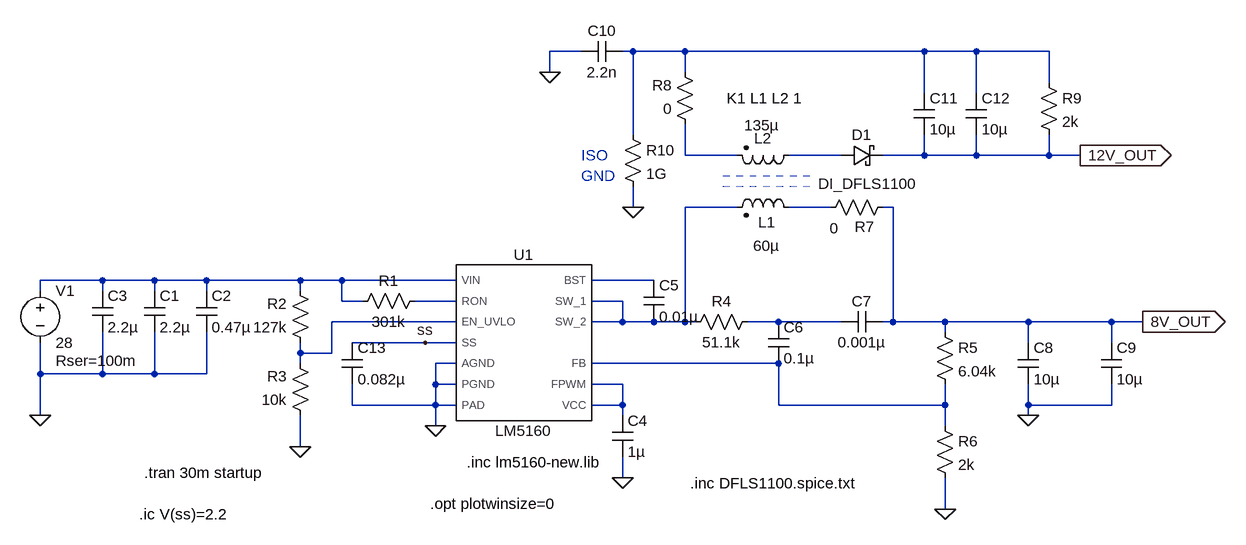
[diagram p0: schematic LM5160prob-fixed.asc]
LM5160prob-fixed.asc, the LTspice schematic file:
Version 4
SHEET 1 1112 680
WIRE 96 -240 48 -240
WIRE 176 -240 160 -240
WIRE 256 -240 176 -240
WIRE 624 -240 256 -240
WIRE 704 -240 624 -240
WIRE 816 -240 704 -240
WIRE 48 -208 48 -240
WIRE 256 -208 256 -240
WIRE 816 -192 816 -240
WIRE 624 -176 624 -240
WIRE 704 -176 704 -240
WIRE 176 -112 176 -240
WIRE 256 -80 256 -128
WIRE 336 -80 256 -80
WIRE 496 -80 416 -80
WIRE 624 -80 624 -112
WIRE 624 -80 560 -80
WIRE 704 -80 704 -112
WIRE 704 -80 624 -80
WIRE 816 -80 816 -112
WIRE 816 -80 704 -80
WIRE 864 -80 816 -80
WIRE 176 0 176 -32
WIRE 336 0 256 0
WIRE 480 0 416 0
WIRE 576 0 560 0
WIRE -640 112 -736 112
WIRE -560 112 -640 112
WIRE -480 112 -560 112
WIRE -336 112 -480 112
WIRE -272 112 -336 112
WIRE -96 112 -272 112
WIRE 208 112 112 112
WIRE -736 128 -736 112
WIRE -640 128 -640 112
WIRE -560 128 -560 112
WIRE -480 128 -480 112
WIRE -336 128 -336 112
WIRE -272 144 -272 112
WIRE -240 144 -272 144
WIRE -96 144 -160 144
WIRE 160 144 112 144
WIRE -96 176 -288 176
WIRE 160 176 160 144
WIRE 160 176 112 176
WIRE 208 176 160 176
WIRE 256 176 256 0
WIRE 256 176 208 176
WIRE 272 176 256 176
WIRE 400 176 352 176
WIRE 496 176 400 176
WIRE 576 176 576 0
WIRE 576 176 560 176
WIRE 656 176 576 176
WIRE 784 176 656 176
WIRE 912 176 784 176
WIRE 960 176 912 176
WIRE 656 192 656 176
WIRE -144 208 -256 208
WIRE -96 208 -144 208
WIRE 784 208 784 176
WIRE 912 208 912 176
WIRE -336 224 -336 208
WIRE -288 224 -288 176
WIRE -288 224 -336 224
WIRE -336 240 -336 224
WIRE -96 240 -128 240
WIRE 400 240 112 240
WIRE -736 256 -736 208
WIRE -640 256 -640 192
WIRE -640 256 -736 256
WIRE -560 256 -560 192
WIRE -560 256 -640 256
WIRE -480 256 -480 192
WIRE -480 256 -560 256
WIRE -128 272 -128 240
WIRE -96 272 -128 272
WIRE 160 272 112 272
WIRE -256 304 -256 272
WIRE -128 304 -128 272
WIRE -128 304 -256 304
WIRE -96 304 -128 304
WIRE 160 304 160 272
WIRE 160 304 112 304
WIRE 400 304 400 240
WIRE 656 304 656 272
WIRE 656 304 400 304
WIRE 784 304 784 272
WIRE 912 304 912 272
WIRE 912 304 784 304
WIRE -736 320 -736 256
WIRE 160 320 160 304
WIRE 784 320 784 304
WIRE -128 336 -128 304
WIRE 656 336 656 304
WIRE -336 368 -336 320
WIRE 160 416 160 384
WIRE 656 464 656 416
FLAG -736 320 0
FLAG -128 336 0
FLAG -336 368 0
FLAG 160 416 0
FLAG 784 320 0
FLAG 656 464 0
FLAG 48 -208 0
FLAG -144 208 ss
FLAG 864 -80 12V_OUT
IOPIN 864 -80 Out
FLAG 960 176 8V_OUT
IOPIN 960 176 Out
FLAG 176 0 0
SYMBOL VOLTAGE -736 112 R0
WINDOW 123 0 0 Left 2
WINDOW 39 24 124 Left 2
SYMATTR SpiceLine Rser=100m
SYMATTR InstName V1
SYMATTR Value 28
SYMBOL cap -576 128 R0
SYMATTR InstName C1
SYMATTR Value 2.2µ
SYMATTR SpiceLine V=50 Irms=5.54 Rser=0.0279723 Lser=0 mfg="KEMET" pn="C1812C225K5RAC" type="X7R"
SYMBOL cap -496 128 R0
SYMATTR InstName C2
SYMATTR Value 0.47µ
SYMATTR SpiceLine V=50 Irms=1.32 Rser=0.0460968 Lser=0 mfg="KEMET" pn="C1206C474K5RAC" type="X7R"
SYMBOL res -144 128 R90
WINDOW 0 0 56 VBottom 2
WINDOW 3 32 56 VTop 2
SYMATTR InstName R1
SYMATTR Value 301k
SYMBOL res -320 224 R180
WINDOW 0 36 76 Left 2
WINDOW 3 36 40 Left 2
SYMATTR InstName R2
SYMATTR Value 127k
SYMBOL res -320 336 R180
WINDOW 0 36 76 Left 2
WINDOW 3 36 40 Left 2
SYMATTR InstName R3
SYMATTR Value 10k
SYMBOL cap 144 320 R0
SYMATTR InstName C4
SYMATTR Value 1µ
SYMATTR SpiceLine V=16 Irms=0 Rser=0.007 Lser=0 mfg="TDK" pn="C3216X7RIC105K" type="X7R"
SYMBOL cap 192 112 R0
SYMATTR InstName C5
SYMATTR Value 0.01µ
SYMATTR SpiceLine V=16 Irms=272m Rser=0.391699 Lser=0 mfg="KEMET" pn="C0805C103K4RAC" type="X7R"
SYMBOL cap 384 176 R0
SYMATTR InstName C6
SYMATTR Value 0.1µ
SYMATTR SpiceLine V=16 Irms=1.02 Rser=0.0850352 Lser=0 mfg="KEMET" pn="C1206F104K4RAC" type="X7R"
SYMBOL res 368 160 R90
WINDOW 0 0 56 VBottom 2
WINDOW 3 32 56 VTop 2
SYMATTR InstName R4
SYMATTR Value 51.1k
SYMBOL cap 560 160 R90
WINDOW 0 0 32 VBottom 2
WINDOW 3 32 32 VTop 2
SYMATTR InstName C7
SYMATTR Value 0.001µ
SYMATTR SpiceLine V=16 Irms=65.8m Rser=2.70485 Lser=0 mfg="KEMET" pn="C0805C102K4RAC" type="X7R"
SYMBOL res 640 176 R0
SYMATTR InstName R5
SYMATTR Value 6.04k
SYMBOL res 640 320 R0
SYMATTR InstName R6
SYMATTR Value 2k
SYMBOL ind2 432 16 M270
WINDOW 0 -22 50 VTop 2
WINDOW 3 -27 51 VBottom 2
SYMATTR InstName L1
SYMATTR Value 60µ
SYMATTR Type ind
SYMATTR SpiceLine Rser=0.071
SYMBOL ind2 432 -96 R90
WINDOW 0 5 56 VBottom 2
WINDOW 3 -46 58 VTop 2
SYMATTR InstName L2
SYMATTR Value 135µ
SYMATTR Type ind
SYMATTR SpiceLine Rser=0.211
SYMBOL res 576 -16 R90
WINDOW 0 61 44 VBottom 2
WINDOW 3 32 91 VTop 2
SYMATTR InstName R7
SYMATTR Value 0
SYMBOL res 272 -112 R180
WINDOW 0 36 76 Left 2
WINDOW 3 36 40 Left 2
SYMATTR InstName R8
SYMATTR Value 0
SYMBOL cap 160 -256 R90
WINDOW 0 0 32 VBottom 2
WINDOW 3 32 32 VTop 2
SYMATTR InstName C10
SYMATTR Value 2.2n
SYMBOL schottky 496 -64 R270
WINDOW 0 32 32 VTop 2
WINDOW 3 -12 41 VBottom 2
SYMATTR InstName D1
SYMATTR Value DI_DFLS1100
SYMBOL cap 608 -176 R0
SYMATTR InstName C11
SYMATTR Value 10µ
SYMATTR SpiceLine V=16 Irms=7.16 Rser=0.00732742 Lser=0 mfg="KEMET" pn="C1206C106K4PAC" type="X5R"
SYMBOL cap 688 -176 R0
SYMATTR InstName C12
SYMATTR Value 10µ
SYMATTR SpiceLine V=16 Irms=7.16 Rser=0.00732742 Lser=0 mfg="KEMET" pn="C1206C106K4PAC" type="X5R"
SYMBOL res 800 -208 R0
SYMATTR InstName R9
SYMATTR Value 2k
SYMBOL cap -272 208 R0
SYMATTR InstName C13
SYMATTR Value 0.082µ
SYMATTR SpiceLine V=16 Irms=3.31 Rser=0.0495853 Lser=0 mfg="KEMET" pn="C0402C823K4RAC" type="X7R"
SYMBOL LM5160 0 208 R0
SYMATTR InstName U1
SYMBOL cap 768 208 R0
SYMATTR InstName C8
SYMATTR Value 10µ
SYMATTR SpiceLine V=16 Irms=7.16 Rser=0.00732742 Lser=0 mfg="KEMET" pn="C1206C106K4PAC" type="X5R"
SYMBOL cap 896 208 R0
SYMATTR InstName C9
SYMATTR Value 10µ
SYMATTR SpiceLine V=16 Irms=7.16 Rser=0.00732742 Lser=0 mfg="KEMET" pn="C1206C106K4PAC" type="X5R"
SYMBOL cap -656 128 R0
SYMATTR InstName C3
SYMATTR Value 2.2µ
SYMATTR SpiceLine V=50 Irms=5.54 Rser=0.0279723 Lser=0 mfg="KEMET" pn="C1812C225K5RAC" type="X7R"
SYMBOL res 160 -128 R0
SYMATTR InstName R10
SYMATTR Value 1G
TEXT 320 -168 Left 2 !K1 L1 L2 1
TEXT -576 408 Left 2 !.tran 30m startup
TEXT -584 472 Left 2 !.ic V(ss)=2.2
TEXT -80 392 Left 2 !.inc lm5160-new.lib
TEXT 264 424 Left 2 !.inc DFLS1100.spice.txt
TEXT 96 -80 Left 2 ;ISO\nGND
TEXT -136 456 Left 2 !.opt plotwinsize=0
LINE Normal 448 -48 304 -48 2
LINE Normal 448 -32 304 -32 2

The netlist it stands for:
* LM5160prob-fixed.asc
V1 N006 0 28 Rser=100m
C1 N006 0 2.2µ V=50 Irms=5.54 Rser=0.0279723 Lser=0 mfg="KEMET" pn="C1812C225K5RAC" type="X7R"
C2 N006 0 0.47µ V=50 Irms=1.32 Rser=0.0460968 Lser=0 mfg="KEMET" pn="C1206C474K5RAC" type="X7R"
R1 N008 N006 301k
R2 N009 N006 127k
R3 0 N009 10k
C4 N012 0 1µ V=16 Irms=0 Rser=0.007 Lser=0 mfg="TDK" pn="C3216X7RIC105K" type="X7R"
C5 N007 N004 0.01µ V=16 Irms=272m Rser=0.391699 Lser=0 mfg="KEMET" pn="C0805C103K4RAC" type="X7R"
C6 N010 N011 0.1µ V=16 Irms=1.02 Rser=0.0850352 Lser=0 mfg="KEMET" pn="C1206F104K4RAC" type="X7R"
R4 N010 N004 51.1k
C7 8V_OUT N010 0.001µ V=16 Irms=65.8m Rser=2.70485 Lser=0 mfg="KEMET" pn="C0805C102K4RAC" type="X7R"
R5 8V_OUT N011 6.04k
R6 N011 0 2k
L1 N005 N004 60µ Rser=0.071
L2 N003 N002 135µ Rser=0.211
R7 8V_OUT N005 0
R8 N002 N001 0
C10 N001 0 2.2n
D1 N003 12V_OUT DI_DFLS1100
C11 N001 12V_OUT 10µ V=16 Irms=7.16 Rser=0.00732742 Lser=0 mfg="KEMET" pn="C1206C106K4PAC" type="X5R"
C12 N001 12V_OUT 10µ V=16 Irms=7.16 Rser=0.00732742 Lser=0 mfg="KEMET" pn="C1206C106K4PAC" type="X5R"
R9 N001 12V_OUT 2k
C13 ss 0 0.082µ V=16 Irms=3.31 Rser=0.0495853 Lser=0 mfg="KEMET" pn="C0402C823K4RAC" type="X7R"
XU1 0 0 N006 N009 N008 ss N012 N011 N012 N007 N004 N004 0 LM5160  ; pins AGND PGND VIN EN_UVLO RON SS FPWM FB VCC BST SW_1 SW_2 PAD
C8 8V_OUT 0 10µ V=16 Irms=7.16 Rser=0.00732742 Lser=0 mfg="KEMET" pn="C1206C106K4PAC" type="X5R"
C9 8V_OUT 0 10µ V=16 Irms=7.16 Rser=0.00732742 Lser=0 mfg="KEMET" pn="C1206C106K4PAC" type="X5R"
C3 N006 0 2.2µ V=50 Irms=5.54 Rser=0.0279723 Lser=0 mfg="KEMET" pn="C1812C225K5RAC" type="X7R"
R10 N001 0 1G
.model D D
.lib standard.dio
K1 L1 L2 1
.tran 30m startup
.ic V(ss)=2.2
.inc lm5160-new.lib
.inc DFLS1100.spice.txt
* ISO
* GND
.opt plotwinsize=0
.backanno
.end